# Altium schematic sheet 04_Temperature.SchDoc
size A4; DocumentNumber: 4; SheetNumber: 4; SheetTotal: 7
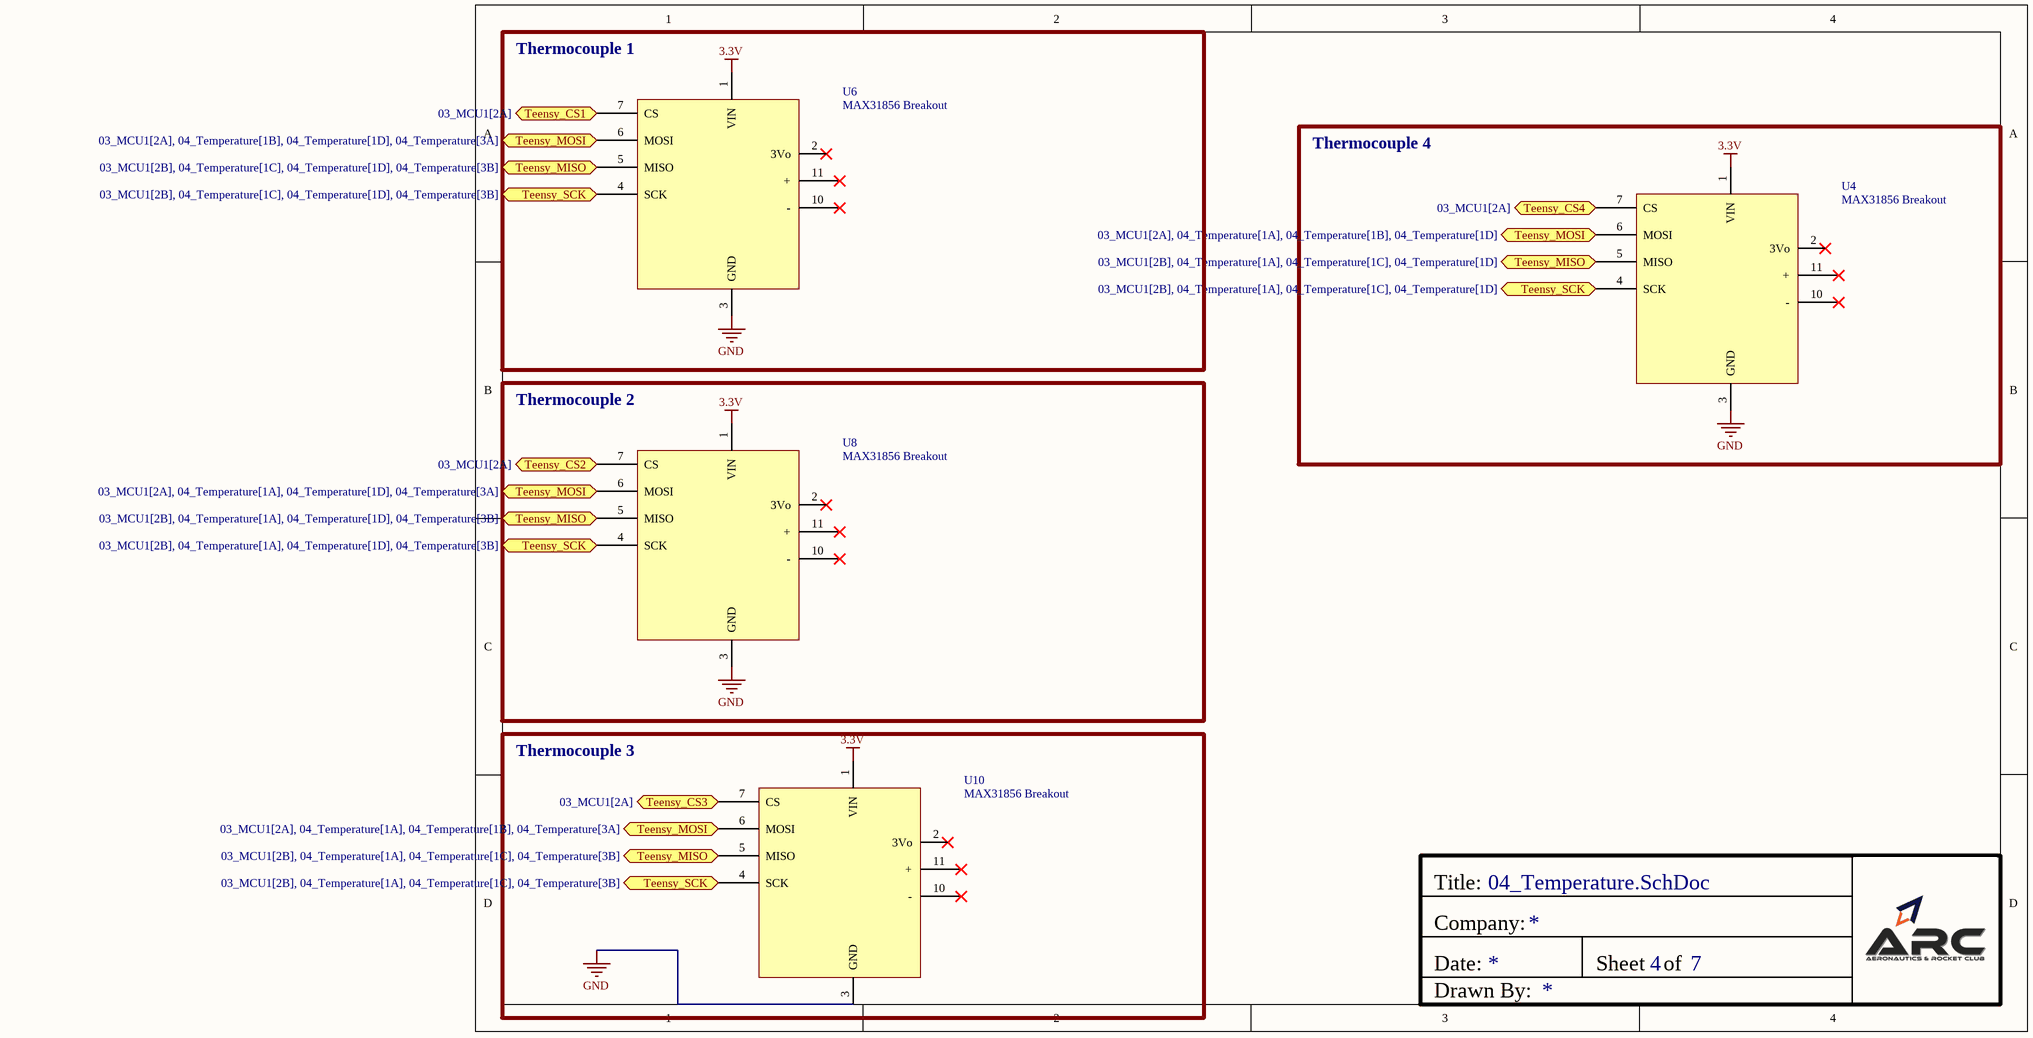
[diagram p0: 04_Temperature.SchDoc]

## Parts
U4  MAX31856 Breakout  [MAX31856 Breakout]
U6  MAX31856 Breakout  [MAX31856 Breakout]
U8  MAX31856 Breakout  [MAX31856 Breakout]
U10  MAX31856 Breakout  [MAX31856 Breakout]

## Blocks framed on the sheet
Thermocouple 1: U6
Thermocouple 4: U4
Thermocouple 2: U8
Thermocouple 3: U10

## Ports
Teensy_CS1 (bidir, see 03_MCU1[2A]), Teensy_CS2 (bidir, see 03_MCU1[2A]), Teensy_CS3 (bidir, see 03_MCU1[2A]), Teensy_CS4 (bidir, see 03_MCU1[2A]), Teensy_MISO (bidir, see 03_MCU1[2B], 04_Temperature[1A], 04_Temperature[1C], 04_Temperature[1D]), Teensy_MISO (bidir, see 03_MCU1[2B], 04_Temperature[1A], 04_Temperature[1C], 04_Temperature[3B]), Teensy_MISO (bidir, see 03_MCU1[2B], 04_Temperature[1A], 04_Temperature[1D], 04_Temperature[3B]), Teensy_MISO (bidir, see 03_MCU1[2B], 04_Temperature[1C], 04_Temperature[1D], 04_Temperature[3B]), Teensy_MOSI (bidir, see 03_MCU1[2A], 04_Temperature[1A], 04_Temperature[1B], 04_Temperature[1D]), Teensy_MOSI (bidir, see 03_MCU1[2A], 04_Temperature[1A], 04_Temperature[1B], 04_Temperature[3A]), Teensy_MOSI (bidir, see 03_MCU1[2A], 04_Temperature[1A], 04_Temperature[1D], 04_Temperature[3A]), Teensy_MOSI (bidir, see 03_MCU1[2A], 04_Temperature[1B], 04_Temperature[1D], 04_Temperature[3A]), Teensy_SCK (bidir, see 03_MCU1[2B], 04_Temperature[1A], 04_Temperature[1C], 04_Temperature[1D]), Teensy_SCK (bidir, see 03_MCU1[2B], 04_Temperature[1A], 04_Temperature[1C], 04_Temperature[3B]), Teensy_SCK (bidir, see 03_MCU1[2B], 04_Temperature[1A], 04_Temperature[1D], 04_Temperature[3B]), Teensy_SCK (bidir, see 03_MCU1[2B], 04_Temperature[1C], 04_Temperature[1D], 04_Temperature[3B])

## Nets
3.3V: U4.1(VIN) U6.1(VIN) U8.1(VIN) U10.1(VIN)
GND: U4.3(GND) U6.3(GND) U8.3(GND) U10.3(GND)
Teensy_CS1: U6.7(CS) ; port Teensy_CS1
Teensy_CS2: U8.7(CS) ; port Teensy_CS2
Teensy_CS3: U10.7(CS) ; port Teensy_CS3
Teensy_CS4: U4.7(CS) ; port Teensy_CS4
Teensy_MISO: U4.5(MISO) U6.5(MISO) U8.5(MISO) U10.5(MISO) ; port Teensy_MISO
Teensy_MOSI: U4.6(MOSI) U6.6(MOSI) U8.6(MOSI) U10.6(MOSI) ; port Teensy_MOSI
Teensy_SCK: U4.4(SCK) U6.4(SCK) U8.4(SCK) U10.4(SCK) ; port Teensy_SCK

Not connected (* = marked no-connect by the designer): U4 2(3Vo)* 10(-)* 11(+)*; U6 2(3Vo)* 10(-)* 11(+)*; U8 2(3Vo)* 10(-)* 11(+)*; U10 2(3Vo)* 10(-)* 11(+)*

## Notes on the sheet
- Title:
- Company:
- Date:
- Sheet
- of
- Drawn By:

## Library data of the parts
U4 U6 U8 U10 = MAX31856 Breakout: Thermocouple amplifier works with any K, J, N, R, S, T, E, or B type thermocouple -210°C to +1800°C output in 0.0078125° resolution 3.3 to 5v power supply and logic level compliant SPI protocol